# EAGLE design NCP1402_5V_step-up-v10 (EAGLE 6.2)
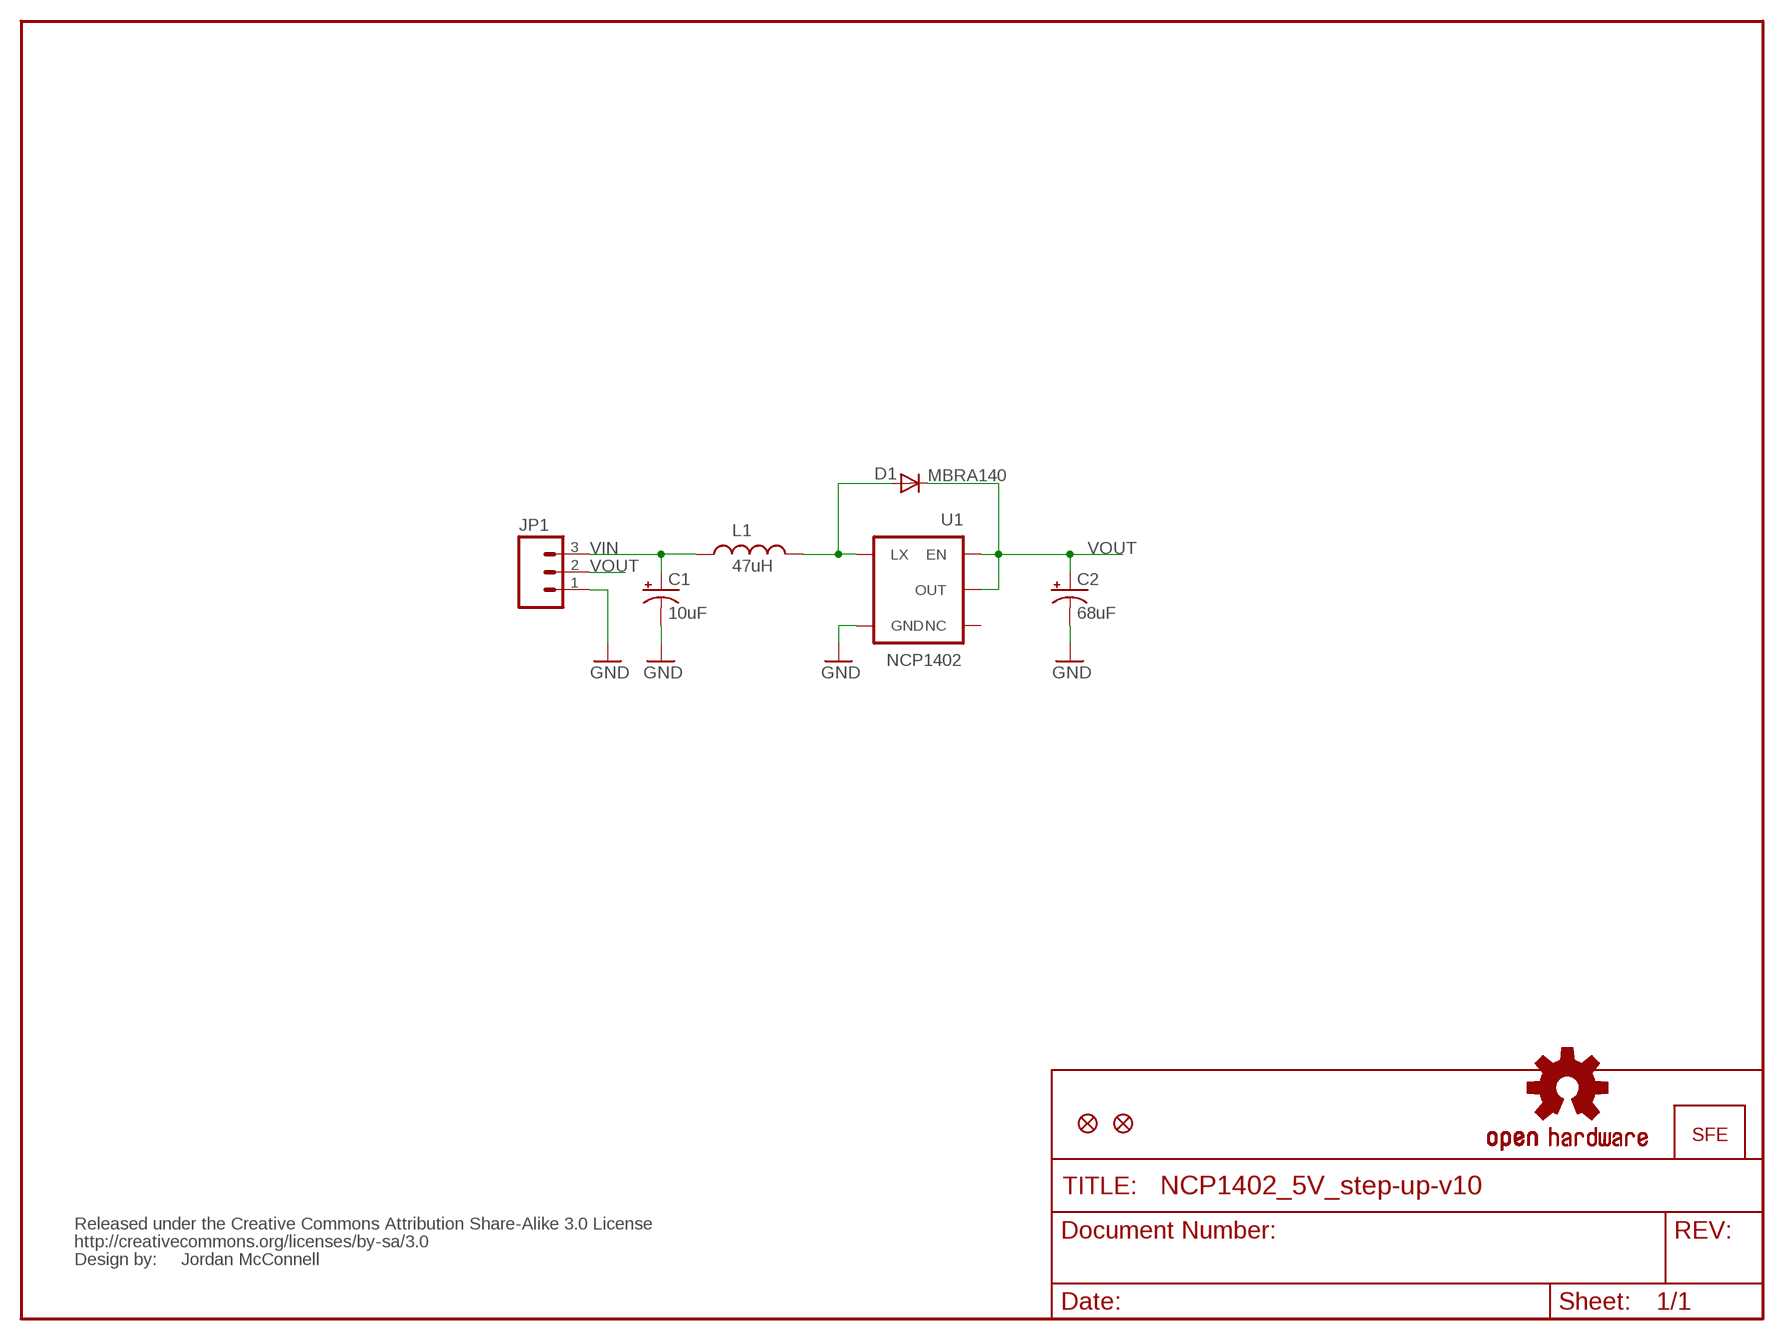
[diagram p0: schematic, sheet 1]

## Parts
C1  10uF  CAP_POL1206  [EIA3216]
C2  68uF  CAP_POL3528  [EIA3528]
D1  MBRA140  DIODESMA  [SMA-DIODE]
JP1  M03PTH  [1X03]
JP2  LOGO-SFESK  [SFE-LOGO-FLAME]
JP3  FIDUCIALUFIDUCIAL  [MICRO-FIDUCIAL]
JP4  FIDUCIALUFIDUCIAL  [MICRO-FIDUCIAL]
L1  47uH  INDUCTORCR54  [CR54]
U1  NCP1402  V_REG_NCP1400SOT23-5  [SOT23-5]
U$1  OSHW-LOGOS  [OSHW-LOGO-S]
U$2  CREATIVE_COMMONS  [CREATIVE_COMMONS]

## Nets
GND: C1.C(-) C2.C(-) JP1.1 U1.4(GND)
N$3: D1.A L1.P$2 U1.5(LX)
VIN: C1.A(+) JP1.3 L1.P$1
VOUT: C2.A(+) D1.C JP1.2 U1.1(EN) U1.2(OUT)
Unconnected: U1.3(NC)

## Notes on the sheet
- Jordan McConnell

## Library data of the parts
C1 C2 = SparkFun:CAP_POL: Capacitor Polarized These are standard SMD and PTH capacitors. Normally 10uF, 47uF, and 100uF in electrolytic and tantalum varieties. Always verify the external diameter of the through hole cap, it varies with capacity, voltage, and manufacturer. The EIA devices should be standard.
D1 = SparkFun:DIODE: Diode These are standard reverse protection diodes and small signal diodes. SMA package can handle up to about 1A. SOD-323 can handle about 200mA. What the SOD-323 package when ordering, there are some mfgs out there that are 5-pin packages.
JP1 = SparkFun:M03: Header 3 Standard 3-pin 0.1" header. Use with straight break away headers (SKU : PRT-00116), right angle break away headers (PRT-00553), swiss pins (PRT-00743), machine pins (PRT-00117), and female headers (PRT-00115). Molex polarized connector foot print use with SKU : PRT-08232 with associated crimp pins and housings.
JP2 = SparkFun:LOGO-SFE: Spark Fun Electronics PCB Logo This is the standard Spark Fun Electronics PCB logo.
JP3 JP4 = SparkFun:FIDUCIAL: Fiducial Alignment Points Various fiducial points for machine vision alignment.
L1 = SparkFun:INDUCTOR: Inductors Basic Inductor/Choke - 0603 and 1206. Footprints are not proven and vary greatly between part numbers.
U1 = SparkFun:V_REG_NCP1400: Switching step-up voltage regulator NCP1400 switiching regulator takes single cell AA and outputs 100mA at 3.3V or 5V with minimal number of external components.
U$1 = SparkFun:OSHW-LOGO: Open Source Hardware Logo This logo indicates the piece of hardware it is found on incorporates a OSHW license and/or adheres to the definition of open source hardware found here: http://freedomdefined.org/OSHW
U$2 = SparkFun:CREATIVE_COMMONS

## Board
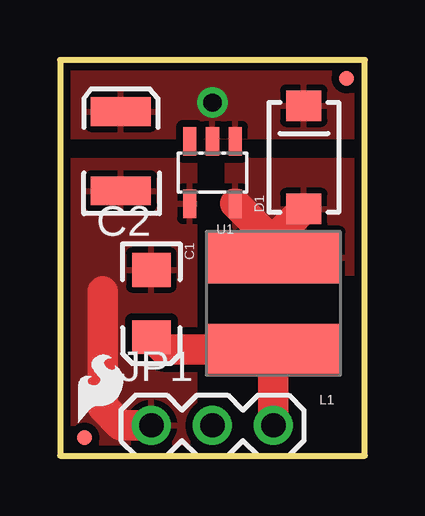
[diagram p1: board, top side]
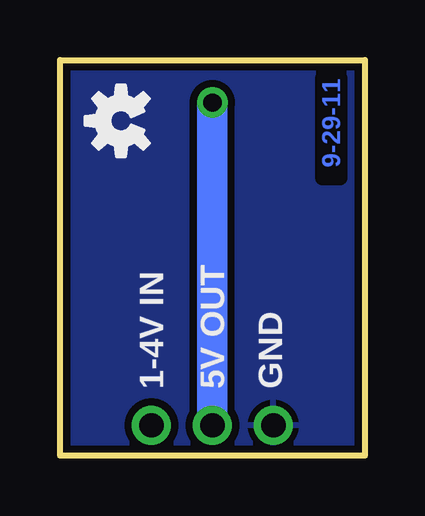
[diagram p2: board, bottom side, seen from below]

Size 12.7 x 16.51 mm. Coordinates in mm from the lower left corner, seen from the top.
Outline: 0,0 12.7,0 12.7,16.51 0,16.51 0,0
Copper layers (1*16): Top 0.035mm / dielectric 1.5mm / Bottom 0.035mm
Design rules: minimum track width 8mil, minimum drill 20mil, track to track 8mil, track to pad 8mil, pad to pad 8mil, via to via 8mil, smd to smd 8mil, copper to edge 8mil, drill to drill 8mil, minimum pad ring 12mil, minimum via ring 10mil, stop-mask expansion 4mil, vias tented up to drill 20mil, thermal gap 10mil

### Footprints (pad centres in the part's own frame; a part is rotated, then mirrored left to right if it is on the bottom)
EIA3216 = smd 1.4 x 1.6: A 1.4,0; C -1.4,0
EIA3528 = smd 1.2 x 2.5: A 1.65,0; C -1.65,0
SMA-DIODE = smd 1.27 x 1.47: A -2.15,0; C 2.15,0
1X03 = drill 1.016: 1 0,0; 2 2.54,0; 3 5.08,0
MICRO-FIDUCIAL = smd 0.635 x 0.635: 1 0,0
CR54 = smd 5.5 x 2.15: P$1 0,1.92; P$2 0,-1.92
SOT23-5 = smd 0.55 x 1.2: 1 -0.95,-1.3; 2 0,-1.3; 3 0.95,-1.3; 4 0.95,1.3; 5 -0.95,1.3

### Placement (x,y rotation side)
C1  3.81,6.35 270 top
C2  2.54,12.7 90 top
D1  10.16,12.45 90 top
JP1  3.81,1.27 0 top
JP2  0.76,1.4 0 top
JP3  11.94,15.75 0 top
JP4  1.02,0.76 0 top
L1  8.89,6.35 180 top
U1  6.35,11.81 180 top
U$1  10.16,13.97 90 bottom
U$2  -12.7,-19.05 0 top  (outside the outline)

### Tracks (layer width: path | path; a pad name or v marks a point on that pad's centre or on a via)
GND
  Top 1.27: JP1.1 2.54,1.27 1.78,2.03 1.78,6.86
  pour Top (isolate 0.305): 0,12.32 5.59,12.32 5.59,0.25 0,0.25
  pour Bottom (isolate 0.305): 0,0 0,16.51 12.7,16.51 12.7,0
N$3
  Top 1.27: D1.A 8.89,9.03 L1.P$2 8.89,8.92 U1.5
  pour Top (isolate 0.305): 6.99,12.32 12.7,12.32 12.7,7.62 6.99,7.62
VIN
  Top 1.27: L1.P$1 JP1.3 | 8.88,4.45 4.32,4.45 C1.A
  Top 1.524: 8.88,4.45 L1.P$1
VOUT  (via drill 0.76)
  Bottom 1.27: JP1.2 v6.35,14.73
  pour Top (isolate 0.305): 12.7,16.51 0,16.51 0,13.34 12.7,13.34

### Text on the board
Bottom: 9-29-11
bPlace: GND | 5V OUT | 1-4V IN
tValues: Jordan McConnell